# Altium schematic sheet MIDI_CV_Converter.SchDoc: MIDI-CV Converter
size Letter; DrawnBy: Nicholas Morrow; Engineer: Nicholas Morrow; Organization: Nicholas Morrow; Address1: UC Santa Barbara; Address2: Physics 127AL; Address3: Spring 2015; DocumentNumber: 4; Revision: a; SheetNumber: 4; SheetTotal: 5; Project: GARY Synthesizer
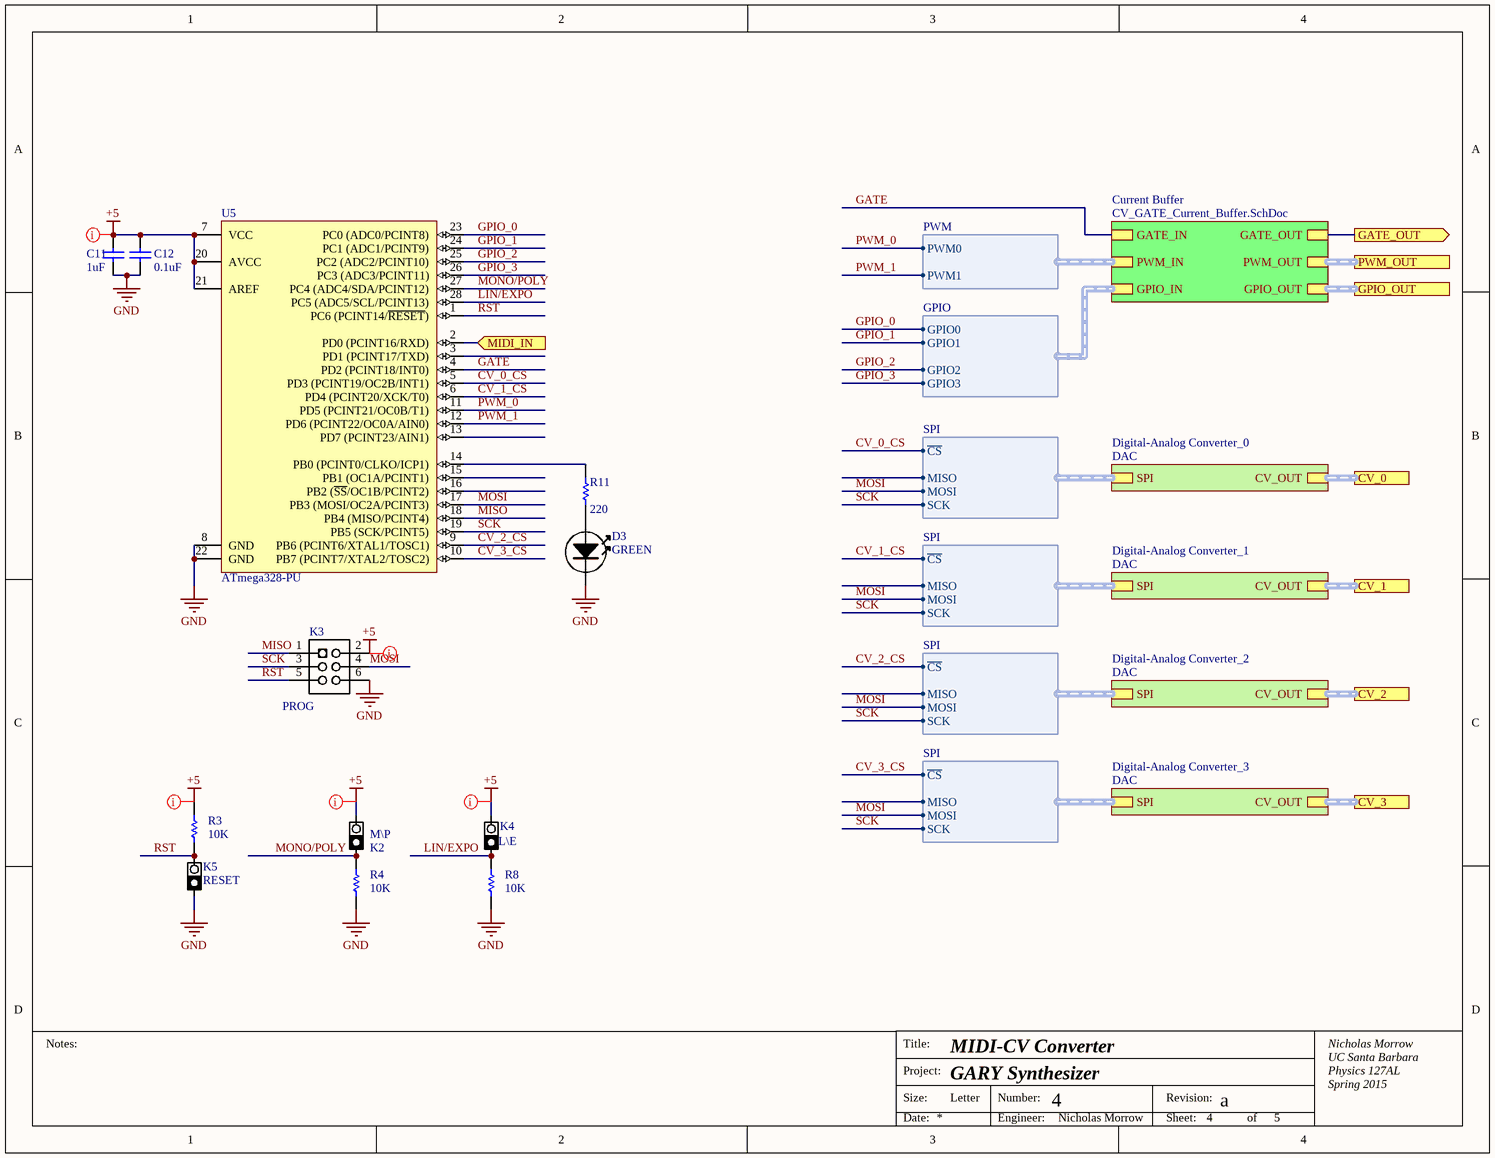
[diagram p0: MIDI_CV_Converter.SchDoc]

## Parts
C11  value 1uF  [CAP 5X11]  (hidden comment: Cap)
C12  value 0.1uF  [CAP 5X11]  (hidden comment: Cap)
D3  GREEN  [LED-5MM-GREEN]
K2  M\P  [JMPR2]
K3  PROG  [HEADER-2X3]
K4  L\E  [JMPR2]
K5  RESET  [JMPR2]
R3  value 10K  [AXIAL-0.3]
R4  value 10K  [AXIAL-0.3]
R8  value 10K  [AXIAL-0.3]
R11  value 220  [AXIAL-0.3]
U5  ATmega328-PU  [28P3]

## Sub-sheets
Current Buffer = CV_GATE_Current_Buffer.SchDoc: GATE_IN, PWM_IN (harness PWM), GPIO_IN (harness GPIO), GATE_OUT, PWM_OUT (harness PWM), GPIO_OUT (harness GPIO)
Digital-Analog Converter_0 = DAC: CV_OUT (harness CV), SPI (harness SPI)
Digital-Analog Converter_1 = DAC: CV_OUT (harness CV), SPI (harness SPI)
Digital-Analog Converter_2 = DAC: CV_OUT (harness CV), SPI (harness SPI)
Digital-Analog Converter_3 = DAC: CV_OUT (harness CV), SPI (harness SPI)

## Ports
CV_0 (harness CV), CV_1 (harness CV), CV_2 (harness CV), CV_3 (harness CV), GATE_OUT (out), GPIO_OUT (harness GPIO), MIDI_IN (in), PWM_OUT (harness PWM)

## Harnesses
PWM: PWM0, PWM1
GPIO: GPIO0, GPIO1, GPIO2, GPIO3
SPI: MISO, MOSI, SCK, ~{CS}

## Nets
+5: C11.2 C12.2 K2.2 K3.2 K4.2 R3.2 U5.7(VCC) U5.20(AVCC) U5.21(AREF)
GND: C11.1 C12.1 D3.K K3.6 K5.1 R4.1 R8.1 U5.8(GND) U5.22(GND)
CV_0_CS: U5.5(PD3_(PCINT19/OC2B/INT1)) ; sheet Digital-Analog Converter_0/SPI.~{CS}
CV_1_CS: U5.6(PD4_(PCINT20/XCK/T0)) ; sheet Digital-Analog Converter_1/SPI.~{CS}
CV_2_CS: U5.9(PB6_(PCINT6/XTAL1/TOSC1)) ; sheet Digital-Analog Converter_2/SPI.~{CS}
CV_3_CS: U5.10(PB7_(PCINT7/XTAL2/TOSC2)) ; sheet Digital-Analog Converter_3/SPI.~{CS}
GATE: U5.4(PD2_(PCINT18/INT0)) ; sheet Current Buffer/GATE_IN
GATE_OUT: port GATE_OUT, sheet Current Buffer/GATE_OUT
GPIO_0: U5.23(PC0_(ADC0/PCINT8)) ; sheet Current Buffer/GPIO_IN.GPIO0
GPIO_1: U5.24(PC1_(ADC1/PCINT9)) ; sheet Current Buffer/GPIO_IN.GPIO1
GPIO_2: U5.25(PC2_(ADC2/PCINT10)) ; sheet Current Buffer/GPIO_IN.GPIO2
GPIO_3: U5.26(PC3_(ADC3/PCINT11)) ; sheet Current Buffer/GPIO_IN.GPIO3
LIN/EXPO: K4.1 R8.2 U5.28(PC5_(ADC5/SCL/PCINT13))
MIDI_IN: U5.2(PD0_(PCINT16/RXD)) ; port MIDI_IN
MISO: K3.1 U5.18(PB4_(MISO/PCINT4))
MONO/POLY: K2.1 R4.2 U5.27(PC4_(ADC4/SDA/PCINT12))
MOSI: K3.4 U5.17(PB3_(MOSI/OC2A/PCINT3)) ; sheet Digital-Analog Converter_0/SPI.MOSI, sheet Digital-Analog Converter_1/SPI.MOSI, sheet Digital-Analog Converter_2/SPI.MOSI, sheet Digital-Analog Converter_3/SPI.MOSI
PWM_0: U5.11(PD5_(PCINT21/OC0B/T1)) ; sheet Current Buffer/PWM_IN.PWM0
PWM_1: U5.12(PD6_(PCINT22/OC0A/AIN0)) ; sheet Current Buffer/PWM_IN.PWM1
RST: K3.5 K5.2 R3.1 U5.1(PC6_(PCINT14/~{RESET}))
SCK: K3.3 U5.19(PB5_(SCK/PCINT5)) ; sheet Digital-Analog Converter_0/SPI.SCK, sheet Digital-Analog Converter_1/SPI.SCK, sheet Digital-Analog Converter_2/SPI.SCK, sheet Digital-Analog Converter_3/SPI.SCK
NetD3_A: D3.A R11.1
NetR11_2: R11.2 U5.14(PB0_(PCINT0/CLKO/ICP1))

Not connected (* = marked no-connect by the designer): U5 3(PD1_(PCINT17/TXD)) 13(PD7_(PCINT23/AIN1)) 15(PB1_(OC1A/PCINT1)) 16(PB2_(~{SS}/OC1B/PCINT2))

## Buses and harness runs
harness port CV_0 = sheet Digital-Analog Converter_0/CV_OUT
harness port CV_1 = sheet Digital-Analog Converter_1/CV_OUT
harness port CV_2 = sheet Digital-Analog Converter_2/CV_OUT
harness port CV_3 = sheet Digital-Analog Converter_3/CV_OUT
harness port GPIO_OUT = sheet Current Buffer/GPIO_OUT
harness port PWM_OUT = sheet Current Buffer/PWM_OUT

## Layout directives
net class Power: +5

## Notes on the sheet
- Notes:
- Title:
- Size:
- Project:
- Letter
- Number:
- Revision:
- Date:
- Engineer:
- Sheet:
- of

## Library data of the parts
C11 C12 = Cap: Capacitor; Published: 8-Jun-2000; LatestRevisionDate: 17-Jul-2002; LatestRevisionNote: Re-released for DXP Platform.; PackageReference: RAD-0.3; Publisher: Altium Limited; PackageDescription: Radial Cap, Thru-Hole; 2 Leads; 0.3 in Pin Spacing
D3 = LED-GREEN-5MM
K2 K4 K5 = JMPR2: JMPR2 OPEN BY DEFAULT; Manufacturer: Sullins Connector Solutions; Manufacturer Part Number: PBC36SAAN; Supplier 1: Digi-Key; Supplier Part Number 1: S1011E-36-ND; Reel: Open
K3 = HEADER-2X3
R3 R4 R8 R11 = Res1: Resistor; Published: 8-Jun-2000; LatestRevisionDate: 17-Jul-2002; LatestRevisionNote: Re-released for DXP Platform.; PackageReference: AXIAL-0.3; Publisher: Altium Limited; PackageDescription: Axial Device, Thru-Hole; 2 Leads; 0.3 in Pin Spacing
U5 = ATmega328-PU: 8-bit AVR Microcontroller, 32KB Flash, 1KB EEPROM, 2KB SRAM, 28-pin PDIP, Industrial Grade (-40°C to 85°C); Published: 1-Apr-2010; DatasheetVersion: revA, Jan-2010; PackageVersion: revB, Sep-2001; PackageReference: 28P3; Publisher: Altium Limited; PackageDescription: 28-lead (0.300"/7.62mm Wide) Plastic Dual Inline Package (PDIP); Supplier 1: Digi-Key; Supplier Part Number 1: ATMEGA328-PU-ND; Supplier 2: Mouser; Supplier Part Number 2: 556-ATMEGA328-PU; ComponentLink1Description: Manufacturer Link; ComponentLink1URL: http://www.atmel.com/products/avr/default.asp?; ComponentLink2Description: ATmega48A/48PA/88A/88PA/168A/168PA/328/328P Datasheet; ComponentLink2URL: http://www.atmel.com/dyn/resources/prod_documents/8271.pdf; ComponentLink3Description: ATmega48A/48PA/88A/88PA/168A/168PA/328/328P Summary; ComponentLink3URL: http://www.atmel.com/dyn/resources/prod_documents/8271S.pdf; ComponentLink4Description: Atmel.com Home; ComponentLink4URL: http://www.atmel.com